# Altium schematic sheet test_led.SchDoc: Test LEDs
size B; Engineer: ENTER ENGINEER NAME; Organization: CUAir; Address1: L3, 12a Rodborough Rd; Address2: Frenchs Forest; Address3: NSW; Address4: Australia 2086; Revision: 1; SheetNumber: 8; SheetTotal: 9; CompetitionYear: 2025; CPN: N/A; PROJECT: Current Logging and Validation Board
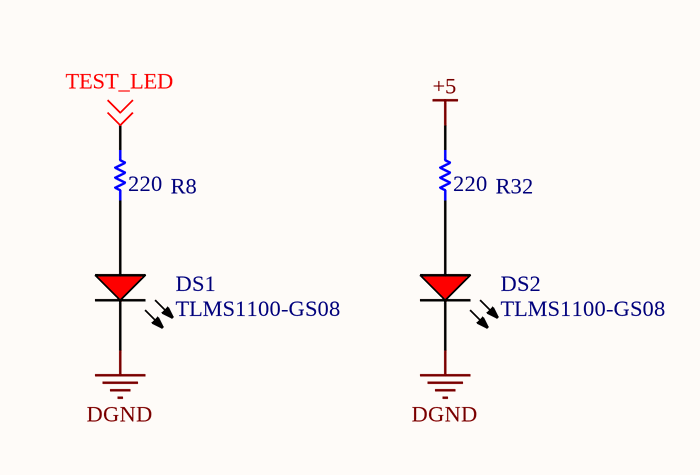
[diagram p0: test_led.SchDoc]

## Parts
DS1  TLMS1100-GS08  [VISH-TLMX1100_V]
DS2  TLMS1100-GS08  [VISH-TLMX1100_V]
R8  220  [0805]
R32  220  [0805]

## Nets
+5: R32.2
DGND: DS1.2(K) DS2.2(K)
TEST_LED: R8.2 ; off-sheet TEST_LED
NetDS1_1: DS1.1(A) R8.1
NetDS2_1: DS2.1(A) R32.1

## Notes on the sheet
- Project
- Title
- Size:
- Date:
- B
- Number:
- Revision:
- File:

## Library data of the parts
DS1 DS2 = CMP-007-00030-2: Red Led, 20mA, 2.1 V, -40 to 100 degC, 2-Pin SMD (0603), RoHS, Tape and Reel; Manufacturer: Vishay Semiconductor; Viewing Angle: 160degrees; Forward Voltage: 2.1V; Lens Style: Clear; Power: 90mW; Luminous Intensity: 63mcd; Datasheet Version: Rev. 2.7, 03/2016; Package Quantity: 3000; Colour: Red; Package Description: 2-Pin Surface Mount Device, Body 1.6 x 0.8 mm; Datasheet URL: http://www.vishay.com/docs/83173/tlmb1100.pdf; Package Reference: TLMX1100; Max Operating Temperature: 100°C; Mounting Technology: SM; Packaging: TapeandReel; Case/Package: 0603; Illumination Colour: Red; Forward Current: 20mA; Manufacturer URL: http://www.vishay.com/; RoHS Compliant: True; Min Operating Temperature: -40°C; Nominal Vf: 2.1V; Pins: 2
R8 R32 = 220: RES Thick Film, 220Ω, 0.125W, 150V, 0805; MPN: 0805W8F2200T5E; Manufacturer: UNI-ROYAL; Power Rating: 125mW; JLCPCB Part #: C17557; Voltage Rating: 150V; ComponentLink1Description: Source; ComponentLink1URL: https://jlcpcb.com/partdetail/18245-0805W8F2200T5E/C17557; Value: 220; JLCPCB Basic Part: TRUE